# EAGLE design schematic (EAGLE 7.7.0)
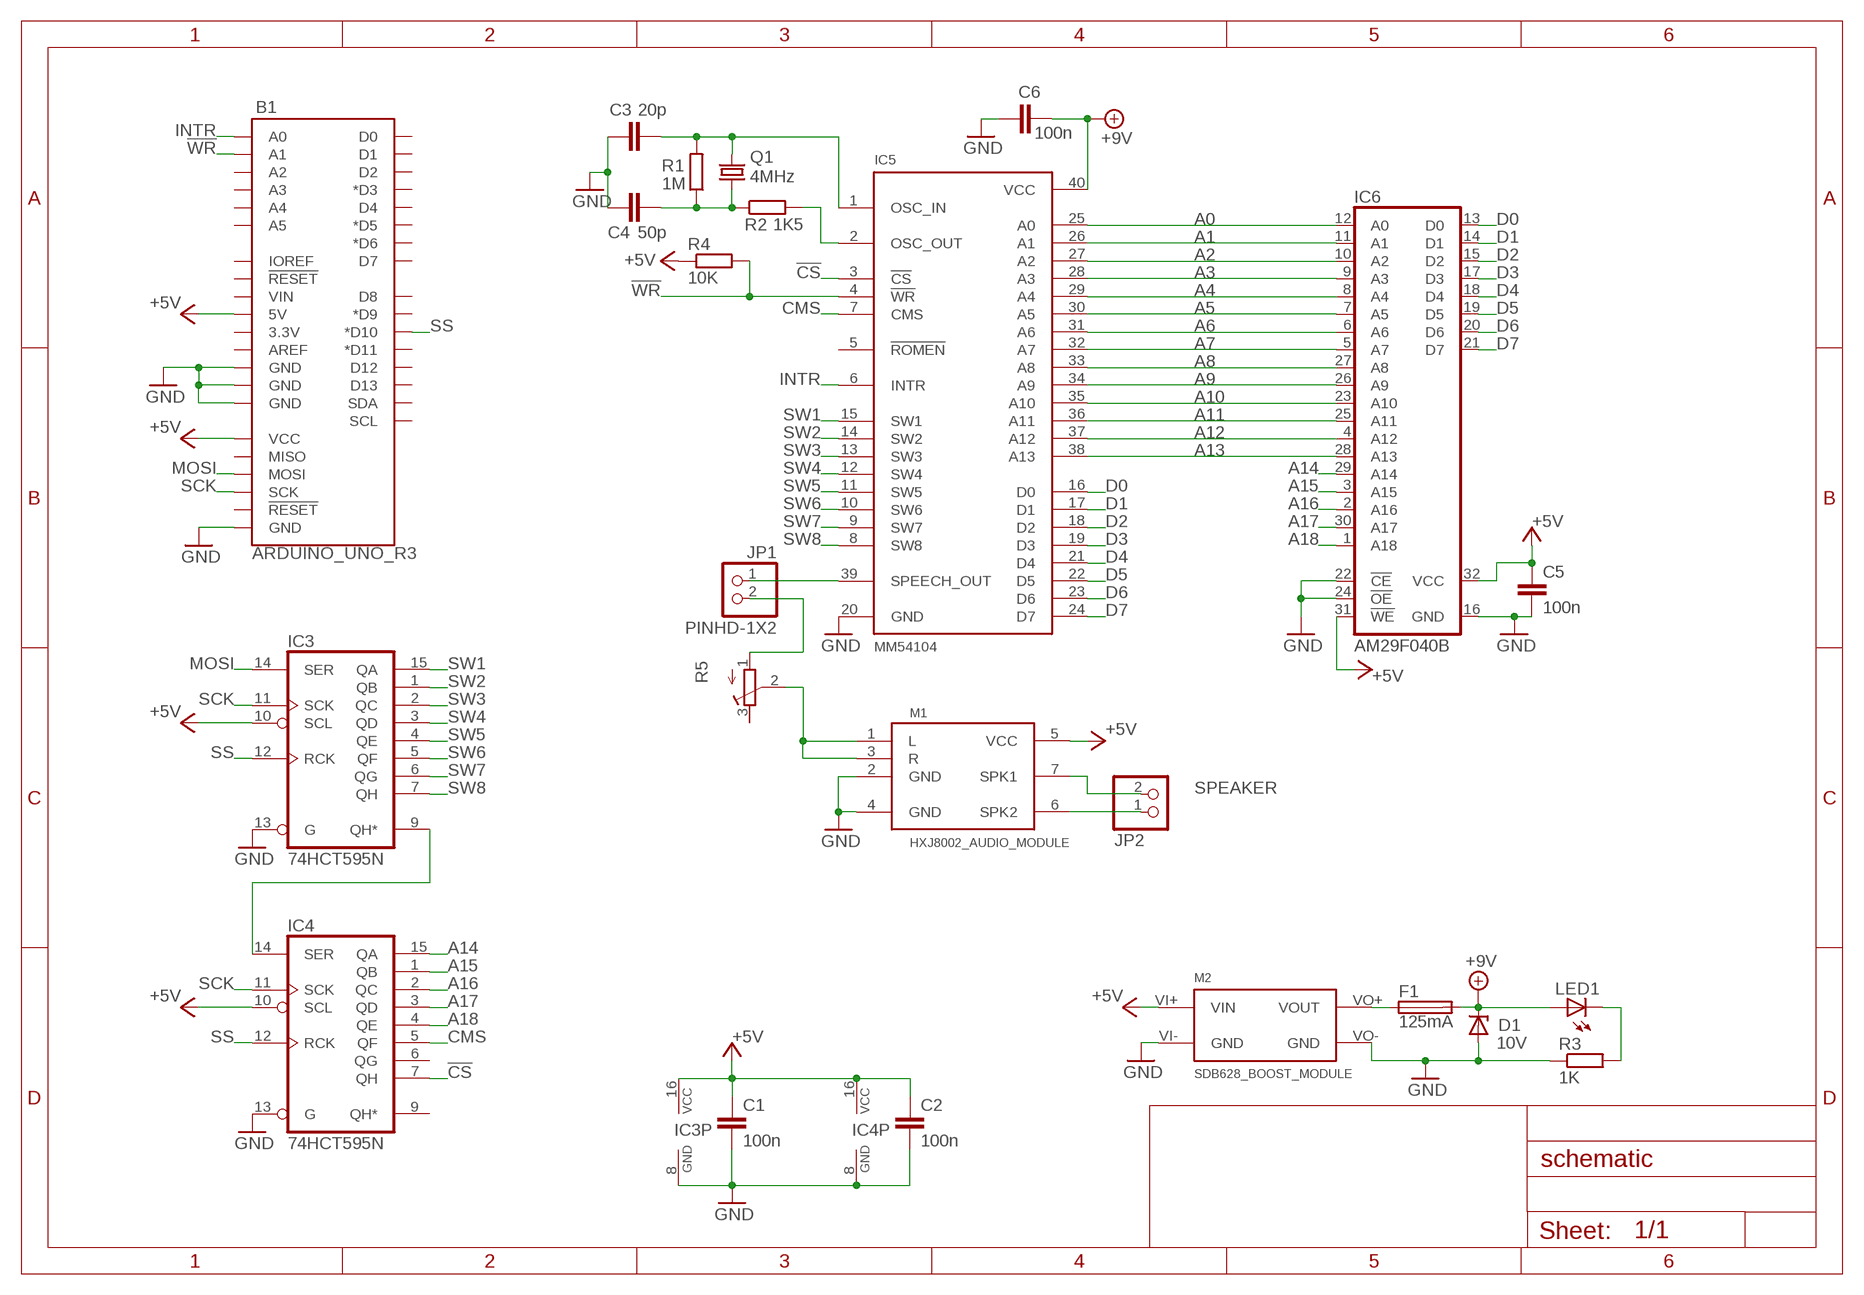
[diagram p0: schematic, sheet 1]

## Parts
B1  ARDUINO_UNO_R3  [ARDUINO_R3]
C1  100n  C-EUC0805K  [C0805K]
C2  100n  C-EUC0805K  [C0805K]
C3  20p  C-EUC0805K  [C0805K]
C4  50p  C-EUC0805K  [C0805K]
C5  100n  C-EUC0805K  [C0805K]
C6  100n  C-EUC0805K  [C0805K]
D1  10V  ZENER-DIODEF126-12  [F126Z12]
F1  125mA  FUSETE5  [TE5]
IC3  74HCT595N  [DIL16]
IC4  74HCT595N  [DIL16]
IC5  MM54104  [DIL40]
IC6  AM29F040B  [PLCC32]
JP1  PINHD-1X2  [1X02]
JP2  PINHD-1X2/90  [1X02/90]
LED1  LEDCHIPLED_1206  [CHIPLED_1206]
M1  HXJ8002_AUDIO_MODULE  [HXJ8002]
M2  SDB628_BOOST_MODULE  [SDB628_MODULE]
Q1  4MHz  CRYSTALHC49S  [HC49/S]
R1  1M  R-EU_R0805  [R0805]
R2  1K5  R-EU_R0805  [R0805]
R3  1K  R-EU_R0805W  [R0805W]
R4  10K  R-EU_R0805W  [R0805W]
R5  R-TRIMM3296W  [RTRIM3296W]

## Nets
!CS: IC4.7(QH) IC5.3(!CS)
!WR: B1.A1 IC5.4(!WR) R4.2
+5V: B1.5V B1.VCC C1.1 C2.1 C5.1 IC3.10(SCL) IC3.16(VCC) IC4.10(SCL) IC4.16(VCC) IC6.31(!WE) IC6.32(VCC) M1.5(VCC) M2.VI+(VIN) R4.1
+9V: C6.2 D1.C F1.2 IC5.40(VCC) LED1.A
A0: IC5.25(A0) IC6.12(A0)
A1: IC5.26(A1) IC6.11(A1)
A2: IC5.27(A2) IC6.10(A2)
A3: IC5.28(A3) IC6.9(A3)
A4: IC5.29(A4) IC6.8(A4)
A5: IC5.30(A5) IC6.7(A5)
A6: IC5.31(A6) IC6.6(A6)
A7: IC5.32(A7) IC6.5(A7)
A8: IC5.33(A8) IC6.27(A8)
A9: IC5.34(A9) IC6.26(A9)
A10: IC5.35(A10) IC6.23(A10)
A11: IC5.36(A11) IC6.25(A11)
A12: IC5.37(A12) IC6.4(A12)
A13: IC5.38(A13) IC6.28(A13)
A14: IC4.15(QA) IC6.29(A14)
A15: IC4.1(QB) IC6.3(A15)
A16: IC4.2(QC) IC6.2(A16)
A17: IC4.3(QD) IC6.30(A17)
A18: IC4.4(QE) IC6.1(A18)
CMS: IC4.5(QF) IC5.7(CMS)
D0: IC5.16(D0) IC6.13(D0)
D1: IC5.17(D1) IC6.14(D1)
D2: IC5.18(D2) IC6.15(D2)
D3: IC5.19(D3) IC6.17(D3)
D4: IC5.21(D4) IC6.18(D4)
D5: IC5.22(D5) IC6.19(D5)
D6: IC5.23(D6) IC6.20(D6)
D7: IC5.24(D7) IC6.21(D7)
GND: B1.GND@1(GND) B1.GND@2(GND) B1.GND@3(GND) B1.GND@4(GND) C1.2 C2.2 C3.1 C4.1 C5.2 C6.1 D1.A IC3.8(GND) IC3.13(G) IC4.8(GND) IC4.13(G) IC5.20(GND) IC6.16(GND) IC6.22(!CE) IC6.24(!OE) M1.2(GND) M1.4(GND) M2.VI-(GND) M2.VO-(GND) R3.1
INTR: B1.A0 IC5.6(INTR)
MOSI: B1.MOSI IC3.14(SER)
N$1: IC3.9(QH*) IC4.14(SER)
N$2: JP2.1 M1.6(SPK2)
N$3: C4.2 Q1.1 R1.1 R2.1
N$4: C3.2 IC5.1(OSC_IN) Q1.2 R1.2
N$5: IC5.2(OSC_OUT) R2.2
N$6: M1.1(L) M1.3(R) R5.2(S)
N$7: IC5.39(SPEECH_OUT) JP1.1
N$8: JP2.2 M1.7(SPK1)
N$9: F1.1 M2.VO+(VOUT)
N$10: JP1.2 R5.1(A)
N$24: LED1.C R3.2
SCK: B1.SCK IC3.11(SCK) IC4.11(SCK)
SS: B1.D10(*D10) IC3.12(RCK) IC4.12(RCK)
SW1: IC3.15(QA) IC5.15(SW1)
SW2: IC3.1(QB) IC5.14(SW2)
SW3: IC3.2(QC) IC5.13(SW3)
SW4: IC3.3(QD) IC5.12(SW4)
SW5: IC3.4(QE) IC5.11(SW5)
SW6: IC3.5(QF) IC5.10(SW6)
SW7: IC3.6(QG) IC5.9(SW7)
SW8: IC3.7(QH) IC5.8(SW8)
Unconnected: B1.3.3V B1.A2 B1.A3 B1.A4 B1.A5 B1.AREF B1.D0 B1.D1 B1.D2 B1.D3(*D3) B1.D4 B1.D5(*D5) B1.D6(*D6) B1.D7 B1.D8 B1.D9(*D9) B1.D11(*D11) B1.D12 B1.D13 B1.IOREF B1.MISO B1.RESET@1(!RESET!) B1.RESET@2(!RESET!) B1.SCL B1.SDA B1.VIN IC4.6(QG) IC4.9(QH*) IC5.5(!ROMEN) R5.3(E)

## Notes on the sheet
- SPEAKER

## Library data of the parts
B1 = _MyPartsLibrary:ARDUINO_UNO_R3: Arduino R3 Footprint with SPI header Arduino Uno R3 Compatible Footprint. Matches PCB size of the original board. SparkFun Products: SAMD21 Dev Breakout <https://www.sparkfun.com/products/13672> RedBoard <https://www.sparkfun.com/products/12757> R3 Stackable Headers <https://www.sparkfun.com/products/11417>
C1-C6 = rcl:C-EU: CAPACITOR, European symbol
D1 = diode:ZENER-DIODE: Z-Diode
F1 = fuse:FUSE: Fuse; OC_FARNELL: unknown; OC_NEWARK: unknown
IC3 IC4 = _MyPartsLibrary:74*595: 8-bit SHIFT REGISTER, output latch
IC5 = _MyPartsLibrary:MM54104: DIGITALKER Speech IC
IC6 = _MyPartsLibrary:AM29F040B: AM29F040B - 512K x 8 bit FLASH - PLCC32 socket
JP1 = _MyPartsLibrary:PINHD-1X2
JP2 = pinhead:PINHD-1X2: PIN HEADER
LED1 = led:LED: LED OSRAM: - CHIPLED LG R971, LG N971, LY N971, LG Q971, LY Q971, LO R971, LY R971 LH N974, LH R974 LS Q976, LO Q976, LY Q976 LO Q996 - Hyper CHIPLED LW Q18S LB Q993, LB Q99A, LB R99A - SideLED LS A670, LO A670, LY A670, LG A670, LP A670 LB A673, LV A673, LT A673, LW A673 LH A674 LY A675 LS A676, LA A676, LO A676, LY A676, LW A676 LS A679, LY A679, LG A679 - Hyper Micro SIDELED® LS Y876, LA Y876, LO Y876, LY Y876 LT Y87S - SmartLED LW L88C, LW L88S LB L89C, LB L89S, LG L890 LS L89K, LO L89K, LY L89K LS L896, LA L896, LO L896, LY L896 - TOPLED LS T670, LO T670, LY T670, LG T670, LP T670 LSG T670, LSP T670, LSY T670, LOP T670, LYG T670 LG T671, LOG T671, LSG T671 LB T673, LV T673, LT T673, LW T673 LH T674 LS T676, LA T676, LO T676, LY T676, LB T676, LH T676, LSB T676, LW T676 LB T67C, LV T67C, LT T67C, LS T67K, LO T67K, LY T67K, LW E67C LS E67B, LA E67B, LO E67B, LY E67B, LB E67C, LV E67C, LT E67C LW T67C LS T679, LY T679, LG T679 LS T770, LO T770, LY T770, LG T770, LP T770 LB T773, LV T773, LT T773, LW T773 LH T774 LS E675, LA E675, LY E675, LS T675 LS T776, LA T776, LO T776, LY T776, LB T776 LHGB T686 LT T68C, LB T68C - Hyper Mini TOPLED® LB M676 - Mini TOPLED Santana® LG M470 LS M47K, LO M47K, LY M47K Source: http://www.osram.convergy.de LUXEON: - LUMILED® LXK2-PW12-R00, LXK2-PW12-S00, LXK2-PW14-U00, LXK2-PW14-V00 LXK2-PM12-R00, LXK2-PM12-S00, LXK2-PM14-U00 LXK2-PE12-Q00, LXK2-PE12-R00, LXK2-PE12-S00, LXK2-PE14-T00, LXK2-PE14-U00 LXK2-PB12-K00, LXK2-PB12-L00, LXK2-PB12-M00, LXK2-PB14-N00, LXK2-PB14-P00, LXK2-PB14-Q00 LXK2-PR12-L00, LXK2-PR12-M00, LXK2-PR14-Q00, LXK2-PR14-R00 LXK2-PD12-Q00, LXK2-PD12-R00, LXK2-PD12-S00 LXK2-PH12-R00, LXK2-PH12-S00 LXK2-PL12-P00, LXK2-PL12-Q00, LXK2-PL12-R00 Source: www.luxeon.com KINGBRIGHT: KA-3528ASYC Source: www.kingbright.com
M1 = _MyPartsLibrary:HXJ8002_AUDIO_MODULE: HXJ8002 Audio Amplifier Module
M2 = _MyPartsLibrary:SDB628_BOOST_MODULE: SDB628 Step-Up Boost Converter Module
Q1 = crystal:CRYSTAL: CRYSTAL; OC_FARNELL: 1667008; OC_NEWARK: unknown
R1-R4 = rcl:R-EU_: RESISTOR, European symbol
R5 = rcl:R-TRIMM: Trimm resistor

## Board
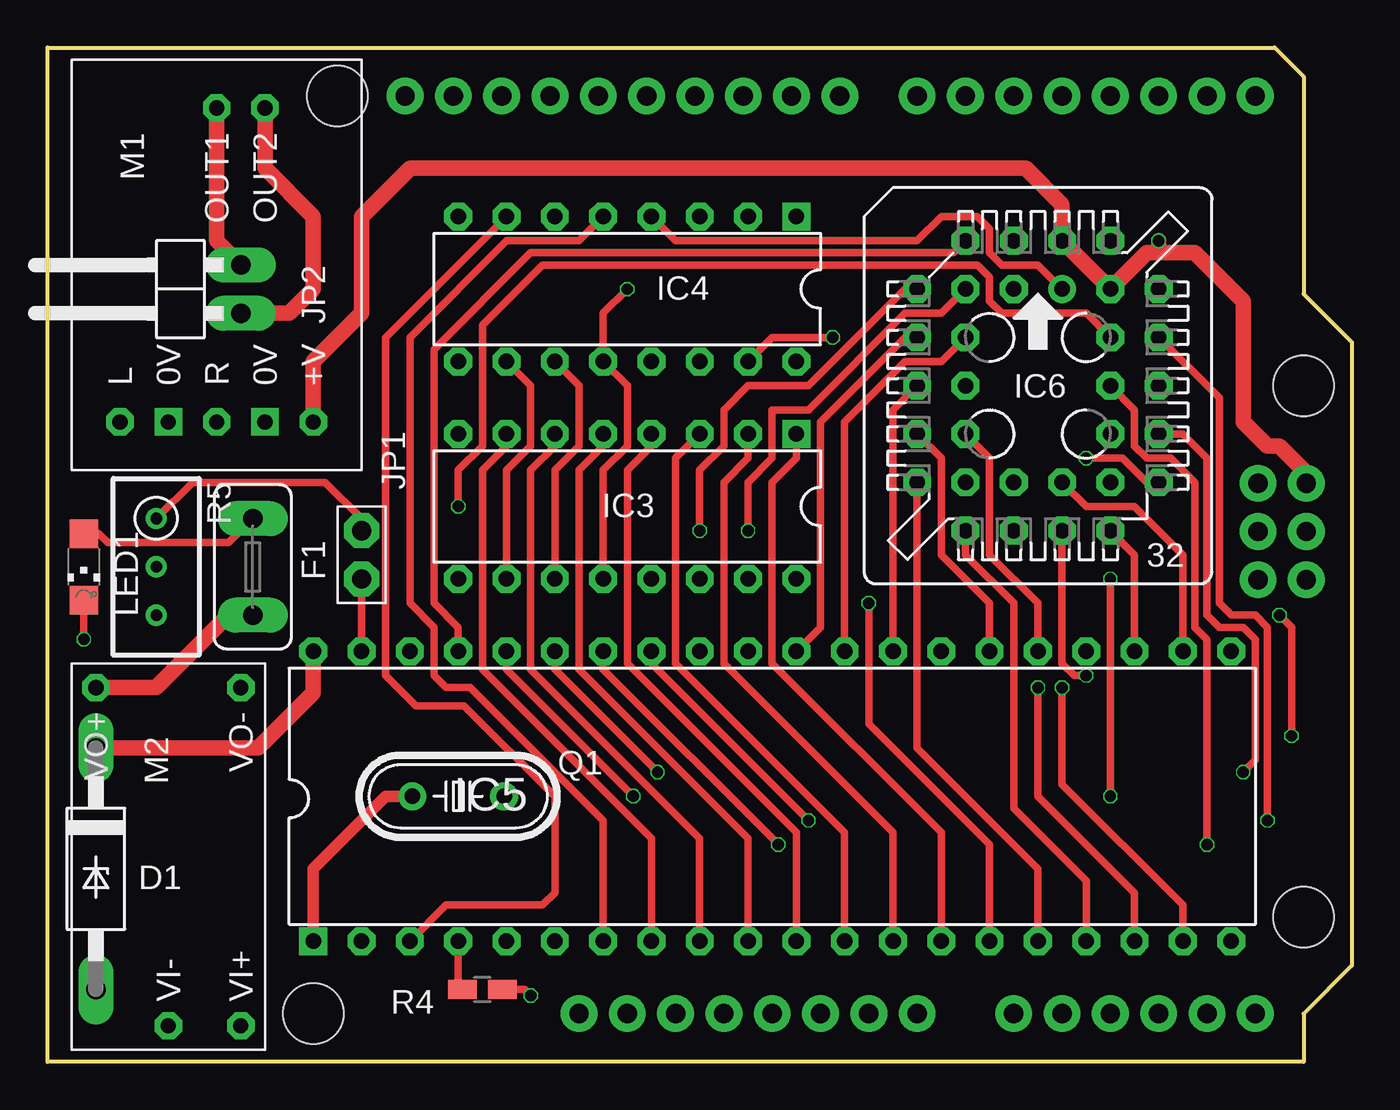
[diagram p1: board, top side]
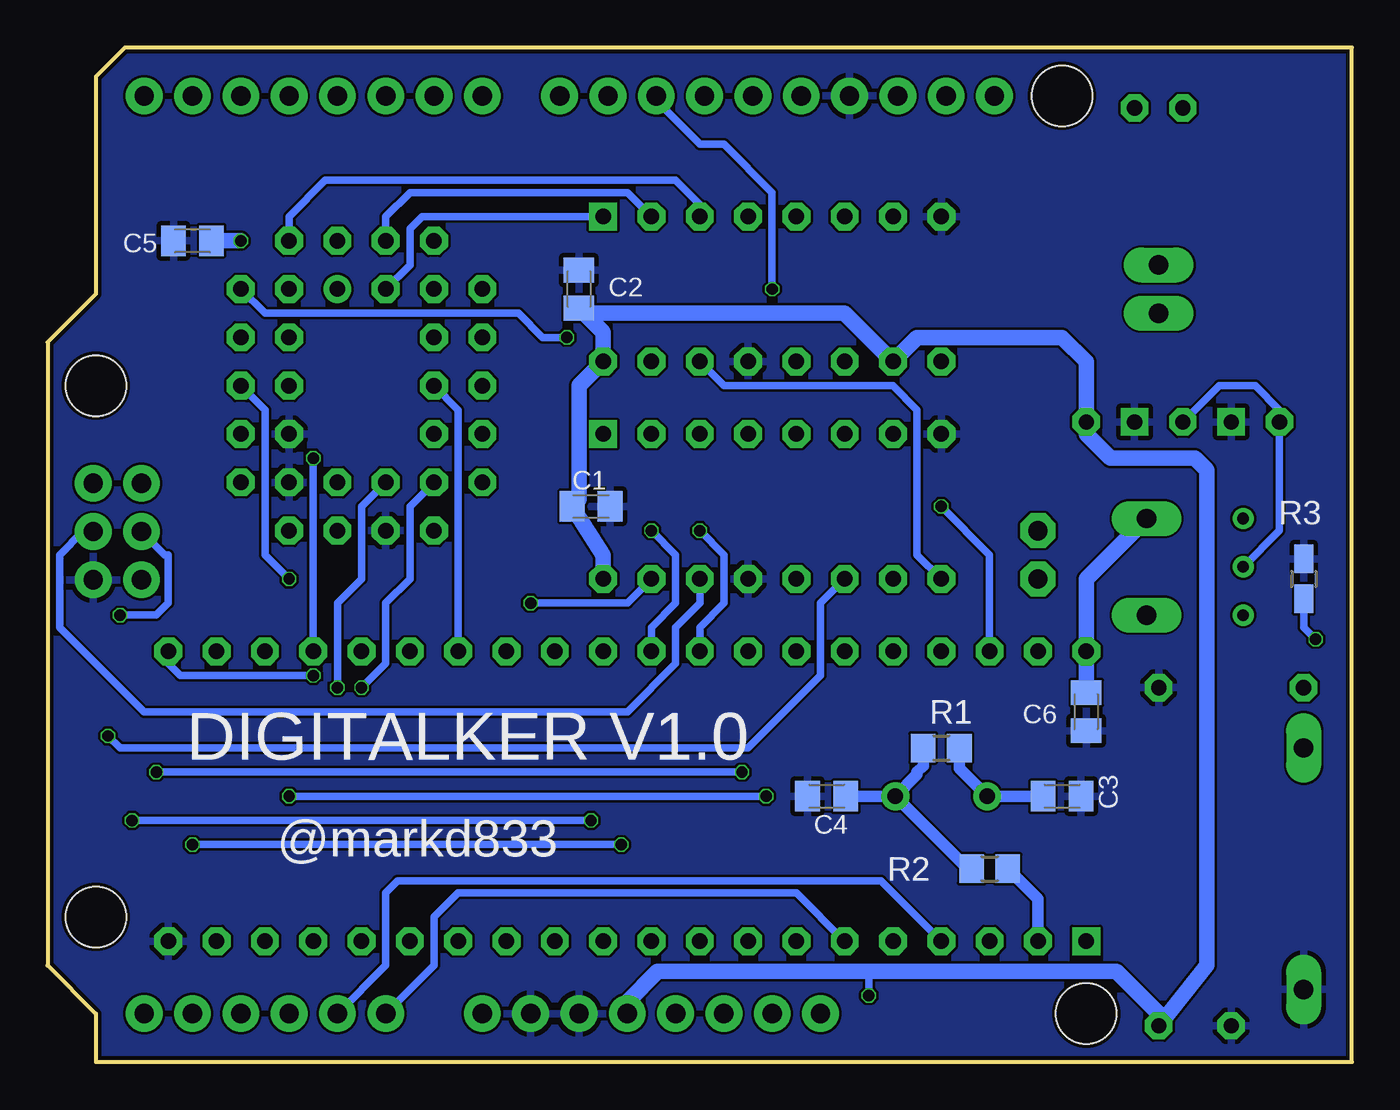
[diagram p2: board, bottom side, seen from below]

Size 68.58 x 53.34 mm. Coordinates in mm from the lower left corner, seen from the top.
Copper layers (1*16): Top 0.035mm / dielectric 1.6mm / Bottom 0.035mm
Design rules "jlcpcb-2layers": minimum track width 5mil, minimum drill 0.3mm, track to track 5mil, track to pad 5mil, pad to pad 5mil, via to via 5mil, smd to smd 5mil, copper to edge 0.2mm, drill to drill 6mil, minimum pad ring 10mil, minimum via ring 3mil, stop-mask expansion 4mil, vias tented up to drill 0mil, thermal gap 10mil

### Footprints (pad centres in the part's own frame; a part is rotated, then mirrored left to right if it is on the bottom)
ARDUINO_R3 = drill 1.016 pad 1.93: 3.3V 2.54,-24.13; 5V 5.08,-24.13; A0 17.78,-24.13; A1 20.32,-24.13; A2 22.86,-24.13; A3 25.4,-24.13; A4 27.94,-24.13; A5 30.48,-24.13; AREF -9.144,24.13; D0 30.48,24.13; D1 27.94,24.13; D2 25.4,24.13; D3 22.86,24.13; D4 20.32,24.13; D5 17.78,24.13; D6 15.24,24.13; D7 12.7,24.13; D8 8.636,24.13; D9 6.096,24.13; D10 3.556,24.13; D11 1.016,24.13; D12 -1.524,24.13; D13 -4.064,24.13; GND@1 7.62,-24.13; GND@2 10.16,-24.13; GND@3 -6.604,24.13; GND@4 33.16,-1.32; IOREF -2.54,-24.13; MISO 30.62,3.76; MOSI 33.16,1.22; NC -5.08,-24.13; RESET@1 0,-24.13; RESET@2 30.62,-1.32; SCK 30.62,1.22; SCL -14.224,24.13; SDA -11.684,24.13; VCC 33.16,3.76; VIN 12.7,-24.13 | hole 3.175: -17.78,24.13; 33.02,8.89; 33.02,-19.05; -19.05,-24.13
C0805K = smd 1.3 x 1.6: 1 -1,0; 2 1,0
F126Z12 = drill 1.016 long: A 6.35,0; C -6.35,0
TE5 = drill 1.016 long: 1 -2.54,0; 2 2.54,0
DIL16 = drill 0.813 square: 1 -8.89,-3.81 | drill 0.813 octagon: 2 -6.35,-3.81; 3 -3.81,-3.81; 4 -1.27,-3.81; 5 1.27,-3.81; 6 3.81,-3.81; 7 6.35,-3.81; 8 8.89,-3.81; 9 8.89,3.81; 10 6.35,3.81; 11 3.81,3.81; 12 1.27,3.81; 13 -1.27,3.81; 14 -3.81,3.81; 15 -6.35,3.81; 16 -8.89,3.81
DIL40 = drill 0.813 square: 1 -24.13,-7.62 | drill 0.813 octagon: 2 -21.59,-7.62; 3 -19.05,-7.62; 4 -16.51,-7.62; 5 -13.97,-7.62; 6 -11.43,-7.62; 7 -8.89,-7.62; 8 -6.35,-7.62; 9 -3.81,-7.62; 10 -1.27,-7.62; 11 1.27,-7.62; 12 3.81,-7.62; 13 6.35,-7.62; 14 8.89,-7.62; 15 11.43,-7.62; 16 13.97,-7.62; 17 16.51,-7.62; 18 19.05,-7.62; 19 21.59,-7.62; 20 24.13,-7.62; 21 24.13,7.62; 22 21.59,7.62; 23 19.05,7.62; 24 16.51,7.62; 25 13.97,7.62; 26 11.43,7.62; 27 8.89,7.62; 28 6.35,7.62; 29 3.81,7.62; 30 1.27,7.62; 31 -1.27,7.62; 32 -3.81,7.62; 33 -6.35,7.62; 34 -8.89,7.62; 35 -11.43,7.62; 36 -13.97,7.62; 37 -16.51,7.62; 38 -19.05,7.62; 39 -21.59,7.62; 40 -24.13,7.62
PLCC32 = drill 0.813: 1 1.27,5.08 | drill 0.813 octagon: 2 -1.27,7.62; 3 -1.27,5.08; 4 -3.81,7.62; 5 -6.35,5.08; 6 -3.81,5.08; 7 -6.35,2.54; 8 -3.81,2.54; 9 -6.35,0; 10 -3.81,0; 11 -6.35,-2.54; 12 -3.81,-2.54; 13 -6.35,-5.08; 14 -3.81,-7.62; 15 -3.81,-5.08; 16 -1.27,-7.62; 17 -1.27,-5.08; 18 1.27,-7.62; 19 1.27,-5.08; 20 3.81,-7.62; 21 6.35,-5.08; 22 3.81,-5.08; 23 6.35,-2.54; 24 3.81,-2.54; 25 6.35,0; 26 3.81,0; 27 6.35,2.54; 28 3.81,2.54; 29 6.35,5.08; 30 3.81,7.62; 31 3.81,5.08; 32 1.27,7.62
1X02 = drill 1.016 pad 1.778 octagon: 1 -2.54,0; 2 0,0
1X02/90 = drill 1.016 long: 1 -1.27,-3.81; 2 1.27,-3.81
CHIPLED_1206 = smd 1.5 x 1.5: A 0,-1.75; C 0,1.75
HXJ8002 = drill 0.8 octagon: 1 -6.35,2.54; 3 -6.35,-2.54; 5 -6.35,-7.62; 6 10.16,-5.08; 7 10.16,-2.54 | drill 0.8 square: 2 -6.35,0; 4 -6.35,-5.08
SDB628_MODULE = drill 0.8 octagon: VI+ -8.89,-3.81; VI- -8.89,0; VO+ 8.89,3.81; VO- 8.89,-3.81
HC49/S = drill 0.813: 1 -2.413,0; 2 2.413,0
R0805 = smd 1.3 x 1.5: 1 -0.95,0; 2 0.95,0
R0805W = smd 1.5 x 1: 1 -1.052,0; 2 1.052,0
RTRIM3296W = drill 0.61: 1 0,-2.54; 2 0,0; 3 0,2.54

### Placement (x,y rotation side)
B1  33.02,26.67 0 top
C1  40.01,29.21 0 bottom
C2  40.64,40.64 90 bottom
C3  15.24,13.97 180 bottom
C4  27.62,13.97 0 bottom
C5  60.96,43.18 180 bottom
C6  13.97,18.41 90 bottom
D1  2.54,10.16 270 top
F1  10.79,26.04 90 top
IC3  30.48,29.21 180 top
IC4  30.48,40.64 180 top
IC5  38.1,13.97 0 top
IC6  52.07,35.56 0 top
JP1  16.51,27.94 90 top
JP2  6.35,40.64 90 top
LED1  1.91,26.04 180 top
M1  6.35,40.01 90 top
M2  6.35,10.79 90 top
Q1  21.59,13.97 180 top
R1  21.59,16.51 0 bottom
R2  19.05,10.16 0 bottom
R3  2.54,25.4 270 bottom
R4  22.86,3.81 180 top
R5  5.71,26.04 180 top

### Tracks (layer width: path | path; a pad name or v marks a point on that pad's centre or on a via)
!CS
  Top 0.406: IC4.7 17.78,38.1 17.78,20.32 19.37,18.73 21.91,18.73 26.67,13.97 26.67,8.89 26.04,8.26 20.95,8.26 IC5.3
!WR
  Top 0.406: R4.2 21.59,3.81 IC5.4
  Bottom 0.406: IC5.4 24.77,9.53 50.16,9.53 50.8,8.89 50.8,5.08 B1.A1
+5V  (via drill 0.6)
  Top 0.406: IC3.10 24.13,31.11 25.4,32.38 25.4,35.56 IC4.10 | R4.1 25.08,3.81 v25.4,3.49
  Top 0.813: 58.42,42.55 57.78,42.55 IC6.31 IC6.32 53.34,45.09 51.44,46.99 19.05,46.99 16.51,44.45 16.51,39.37 13.97,36.83 M1.5 | 58.42,42.55 60.33,42.55 62.87,40.01 62.87,33.66 64.14,32.38 64.77,32.38 66.18,30.98 B1.VCC | v58.42,43.18 58.42,42.55
  Bottom 0.406: v25.4,3.49 25.4,4.76
  Bottom 0.813: IC3.16 39.37,26.67 C1.1 40.64,29.57 40.64,35.56 IC4.16 39.37,38.37 C2.1 40.37,39.37 26.67,39.37 IC4.10 22.86,38.1 15.24,38.1 13.97,36.83 M1.5 13.97,33.02 12.7,31.75 8.26,31.75 7.62,31.11 7.62,5.08 M2.VI+ 10.16,2.54 12.38,4.76 25.4,4.76 36.51,4.76 38.1,3.17 B1.5V | C5.1 v58.42,43.18
+9V
  Top 0.406: LED1.A 2.69,27.79 3.17,27.3 9.53,27.3 F1.2
  Top 0.813: D1.C 11.06,16.51 C6.2 IC5.40
  Bottom 0.813: C6.2 IC5.40 13.97,25.4 F1.2
A0
  Top 0.406: IC5.25 52.07,24.13 49.53,26.67 49.53,31.75 IC6.12
A1
  Top 0.406: IC5.26 49.53,24.13 46.99,26.67 46.99,31.75 IC6.11
A2
  Bottom 0.406: IC6.10 46.99,34.29 IC5.27
A3
  Top 0.406: IC5.28 44.45,34.29 IC6.9
A4
  Top 0.406: IC5.29 41.91,33.66 45.09,36.83 46.99,36.83 IC6.8
A5
  Top 0.406: IC5.30 40.64,22.86 40.64,33.66 45.09,38.1 IC6.7
A6  (via drill 0.6)
  Top 0.406: IC6.6 46.99,39.37 45.09,39.37 40.01,34.29 38.1,34.29 38.1,31.75 36.83,30.48 v36.83,27.94
  Bottom 0.406: v36.83,27.94 35.56,26.67 35.56,24.13 36.83,22.86 IC5.31
A7  (via drill 0.6)
  Top 0.406: v34.29,27.94 34.29,31.11 35.56,32.38 35.56,34.29 36.83,35.56 40.01,35.56 45.09,40.64 IC6.5
  Bottom 0.406: v34.29,27.94 33.02,26.67 33.02,24.13 34.29,22.86 IC5.32
A8  (via drill 0.6)
  Top 0.406: IC6.27 61.59,34.92 61.59,24.13 62.23,23.5 63.5,23.5 64.14,22.86 v64.14,12.7 | IC5.33 31.75,20.95 v40.01,12.7
  Bottom 0.406: v40.01,12.7 v64.14,12.7
A9  (via drill 0.6)
  Top 0.406: IC5.34 29.21,20.64 v38.42,11.43 | IC6.26 57.15,34.29 57.15,32.38 57.78,31.75 59.05,31.75 60.33,30.48 60.33,22.86 60.96,22.23 v60.96,11.43
  Bottom 0.406: v38.42,11.43 v60.96,11.43
A10  (via drill 0.6)
  Top 0.406: IC6.23 59.69,33.02 60.96,31.75 60.96,23.5 61.59,22.86 62.87,22.86 63.5,22.23 63.5,15.88 v62.87,15.24 | IC5.35 26.67,20.64 v32.07,15.24
  Bottom 0.406: v32.07,15.24 v62.87,15.24
A11  (via drill 0.6)
  Top 0.406: v55.88,25.4 v55.88,13.97 | IC5.36 24.13,20.64 v30.8,13.97
  Bottom 0.406: IC6.25 57.15,34.29 57.15,26.67 v55.88,25.4 | v55.88,13.97 v30.8,13.97
A12
  Top 0.406: IC6.4 47.62,42.55 25.4,42.55 20.32,37.47 20.32,24.13 21.59,22.86 IC5.37
A13  (via drill 0.6)
  Top 0.406: IC6.28 54.61,39.37 50.16,39.37 49.53,40.01 49.53,41.27 48.9,41.91 26.04,41.91 22.86,38.73 22.86,32.38 21.59,31.11 v21.59,29.21
  Bottom 0.406: v21.59,29.21 19.05,26.67 IC5.38
A14  (via drill 0.6)
  Top 0.406: v41.27,38.1 38.1,38.1 IC4.15
  Bottom 0.406: IC6.29 57.15,39.37 43.81,39.37 42.55,38.1 v41.27,38.1
A15
  Bottom 0.406: IC6.3 49.53,41.91 49.53,43.81 48.9,44.45 IC4.1
A16
  Bottom 0.406: IC6.2 50.8,44.45 49.53,45.72 38.1,45.72 IC4.2
A17
  Bottom 0.406: IC6.30 55.88,44.45 53.98,46.35 35.56,46.35 34.29,45.09 IC4.3
A18
  Top 0.406: IC6.1 52.07,41.91 50.16,41.91 49.53,42.55 49.53,43.81 48.9,44.45 46.99,44.45 45.72,43.18 33.02,43.18 IC4.4
CMS
  Top 0.406: IC5.7 29.21,12.7 22.23,19.68 20.95,19.68 20.32,20.32 20.32,22.86 19.05,24.13 19.05,38.1 24.13,43.18 27.94,43.18 IC4.5
D0
  Top 0.406: IC6.13 45.72,16.51 52.07,10.16 IC5.16
D1
  Top 0.406: IC6.14 48.26,26.67 50.8,24.13 50.8,13.34 54.61,9.53 IC5.17
D2  (via drill 0.6)
  Top 0.406: v52.07,19.68 52.07,13.97 57.15,8.89 IC5.18
  Bottom 0.406: IC6.15 49.53,29.21 49.53,25.4 50.8,24.13 50.8,20.95 v52.07,19.68
D3  (via drill 0.6)
  Top 0.406: v53.34,19.68 53.34,14.61 59.69,8.26 IC5.19
  Bottom 0.406: IC6.17 52.07,29.21 52.07,25.4 53.34,24.13 v53.34,19.68
D4  (via drill 0.6)
  Top 0.406: IC6.18 53.34,20.95 53.98,20.32 v54.61,20.32
  Bottom 0.406: v54.61,20.32 61.59,20.32 62.23,20.95 IC5.21
D5
  Top 0.406: IC5.22 59.69,26.67 57.15,29.21 54.61,29.21 IC6.19
D6
  Top 0.406: IC5.23 57.15,26.67 IC6.20
D7  (via drill 0.6)
  Top 0.406: IC6.21 57.78,30.48 56.52,31.75 v54.61,31.75
  Bottom 0.406: v54.61,31.75 IC5.24
GND
  pour Bottom: 0,0 0,53.34 64.45,53.34 66.04,51.75 66.04,40.32 68.58,37.78 68.58,5.08 66.04,2.54 66.04,0
INTR
  Bottom 0.406: IC5.6 29.21,8.89 46.99,8.89 48.26,7.62 48.26,5.08 B1.A0
MOSI
  Bottom 0.406: IC3.14 34.29,24.13 35.56,22.86 35.56,20.95 38.1,18.41 63.5,18.41 67.94,22.86 67.94,26.67 66.72,27.89 B1.MOSI
N$1
  Bottom 0.406: IC3.9 22.86,26.67 22.86,34.29 24.13,35.56 33.02,35.56 IC4.14
N$2
  Top 0.813: JP2.1 12.7,39.37 13.97,40.64 13.97,44.45 11.43,46.99 M1.6
N$3
  Bottom 0.61: Q1.1 22.86,15.11 22.86,15.24 22.54,15.56 R1.1 | Q1.1 C4.2 | Q1.1 20.19,10.16 R2.1
N$4
  Top 0.61: IC5.1 13.97,10.16 17.78,13.97 Q1.2
  Bottom 0.61: R1.2 20.64,15.43 Q1.2 C3.2
N$5
  Bottom 0.61: R2.2 16.51,8.57 IC5.2
N$6
  Bottom 0.406: R5.2 3.81,27.94 M1.1 3.81,34.29 5.08,35.56 6.99,35.56 M1.3
N$7
  Top 0.406: IC5.39 JP1.1
N$8
  Top 0.813: M1.7 8.89,43.18 JP2.2
N$9
  Top 0.813: M2.VO+ 5.71,19.68 9.53,23.5 F1.1
N$10
  Top 0.406: JP1.2 16.51,28.57 14.61,30.48 7.62,30.48 R5.1
N$24  (via drill 0.6)
  Top 0.406: LED1.C v1.91,22.23
  Bottom 0.406: v1.91,22.23 2.54,22.86 R3.2
SCK  (via drill 0.6)
  Top 0.406: IC3.11 26.67,31.11 27.94,32.38 27.94,35.56 IC4.11 | v64.77,23.5 65.41,22.86 v65.41,17.14
  Bottom 0.406: B1.SCK 62.42,26.67 62.23,26.67 62.23,24.13 62.87,23.5 v64.77,23.5 | v65.41,17.14 64.77,16.51 31.75,16.51 27.94,20.32 27.94,24.13 IC3.11
SS  (via drill 0.6)
  Top 0.406: IC3.12 29.21,31.11 30.48,32.38 30.48,35.56 IC4.12 29.21,39.37 v30.48,40.64
  Bottom 0.406: v30.48,40.64 30.48,45.72 33.02,48.26 34.29,48.26 36.58,50.55 B1.D10
SW1  (via drill 0.6)
  Top 0.406: v43.18,24.13 43.18,17.78 49.53,11.43 IC5.15
  Bottom 0.406: IC3.15 38.1,24.13 v43.18,24.13
SW2
  Top 0.406: IC5.14 46.99,12.06 38.1,20.95 38.1,30.48 39.37,31.75 IC3.1
SW3
  Top 0.406: IC5.13 44.45,12.06 35.56,20.95 35.56,30.48 36.83,31.75 IC3.2
SW4
  Top 0.406: IC5.12 41.91,12.06 33.02,20.95 33.02,31.75 IC3.3
SW5
  Top 0.406: IC5.11 39.37,12.06 30.48,20.95 30.48,31.11 31.75,32.38 IC3.4
SW6
  Top 0.406: IC5.10 36.83,11.75 27.94,20.64 27.94,31.11 29.21,32.38 IC3.5
SW7
  Top 0.406: IC5.9 34.29,11.75 25.4,20.64 25.4,31.11 26.67,32.38 IC3.6
SW8
  Top 0.406: IC5.8 31.75,11.75 22.86,20.64 22.86,31.11 24.13,32.38 IC3.7

### Text on the board
bNames: DIGITALKER V1.0 | @markd833